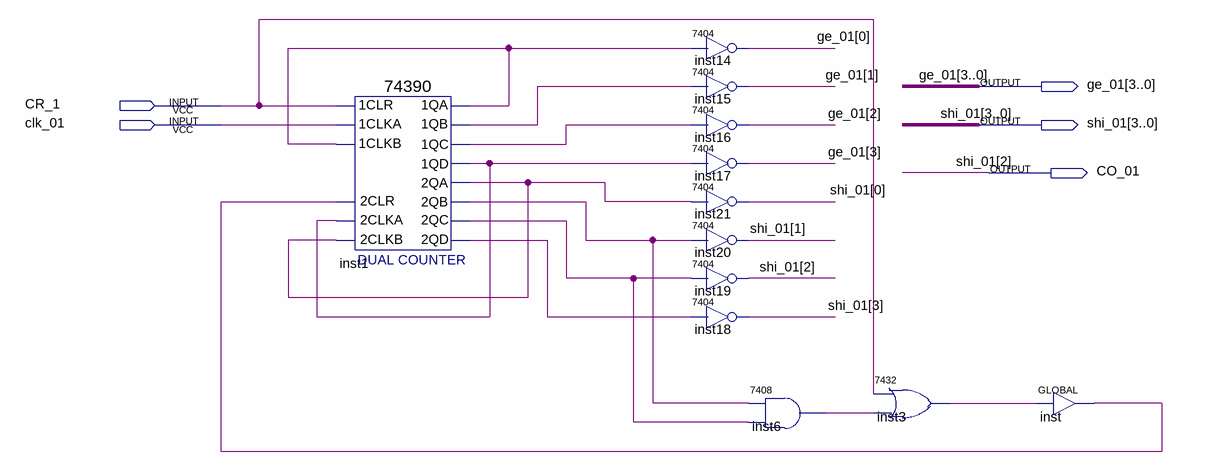
[diagram p0: schematic sheet]
// Quartus schematic minu60.bdf as structural Verilog: 12 symbols, 5 pins
module minu60 (
  input  CR_1,
  input  clk_01,
  output [3:0] ge_01,
  output [3:0] shi_01,
  output CO_01
);

  wire inst1_1qa, inst1_1qb, inst1_1qc, inst1_1qd, inst1_2qa, inst1_2qb, inst1_2qc, inst1_2qd, inst3_1,
       inst6_1, inst_out;

  \74390  inst1 (
    .\2CLKA (inst1_1qd), .\2CLR (inst_out), .\2CLKB (inst1_2qa), .\1CLR (CR_1), .\1CLKA (clk_01),
    .\1CLKB (inst1_1qa), .\1QA (inst1_1qa), .\1QB (inst1_1qb), .\1QC (inst1_1qc), .\1QD (inst1_1qd),
    .\2QA (inst1_2qa), .\2QB (inst1_2qb), .\2QC (inst1_2qc), .\2QD (inst1_2qd));
  \7404  inst14 (.\2 (inst1_1qa), .\1 (ge_01[0]));
  \7404  inst15 (.\2 (inst1_1qb), .\1 (ge_01[1]));
  \7404  inst16 (.\2 (inst1_1qc), .\1 (ge_01[2]));
  \7404  inst17 (.\2 (inst1_1qd), .\1 (ge_01[3]));
  \7404  inst21 (.\2 (inst1_2qa), .\1 (shi_01[0]));
  \7404  inst20 (.\2 (inst1_2qb), .\1 (shi_01[1]));
  \7404  inst19 (.\2 (inst1_2qc), .\1 (CO_01));
  \7404  inst18 (.\2 (inst1_2qd), .\1 (shi_01[3]));
  \7408  inst6 (.\3 (inst1_2qc), .\2 (inst1_2qb), .\1 (inst6_1));
  \7432  inst3 (.\2 (CR_1), .\3 (inst6_1), .\1 (inst3_1));
  GLOBAL inst (.IN(inst3_1), .OUT(inst_out));

  assign shi_01[2] = CO_01;
endmodule
